# Altium schematic sheet CHARGING.SchDoc
size B
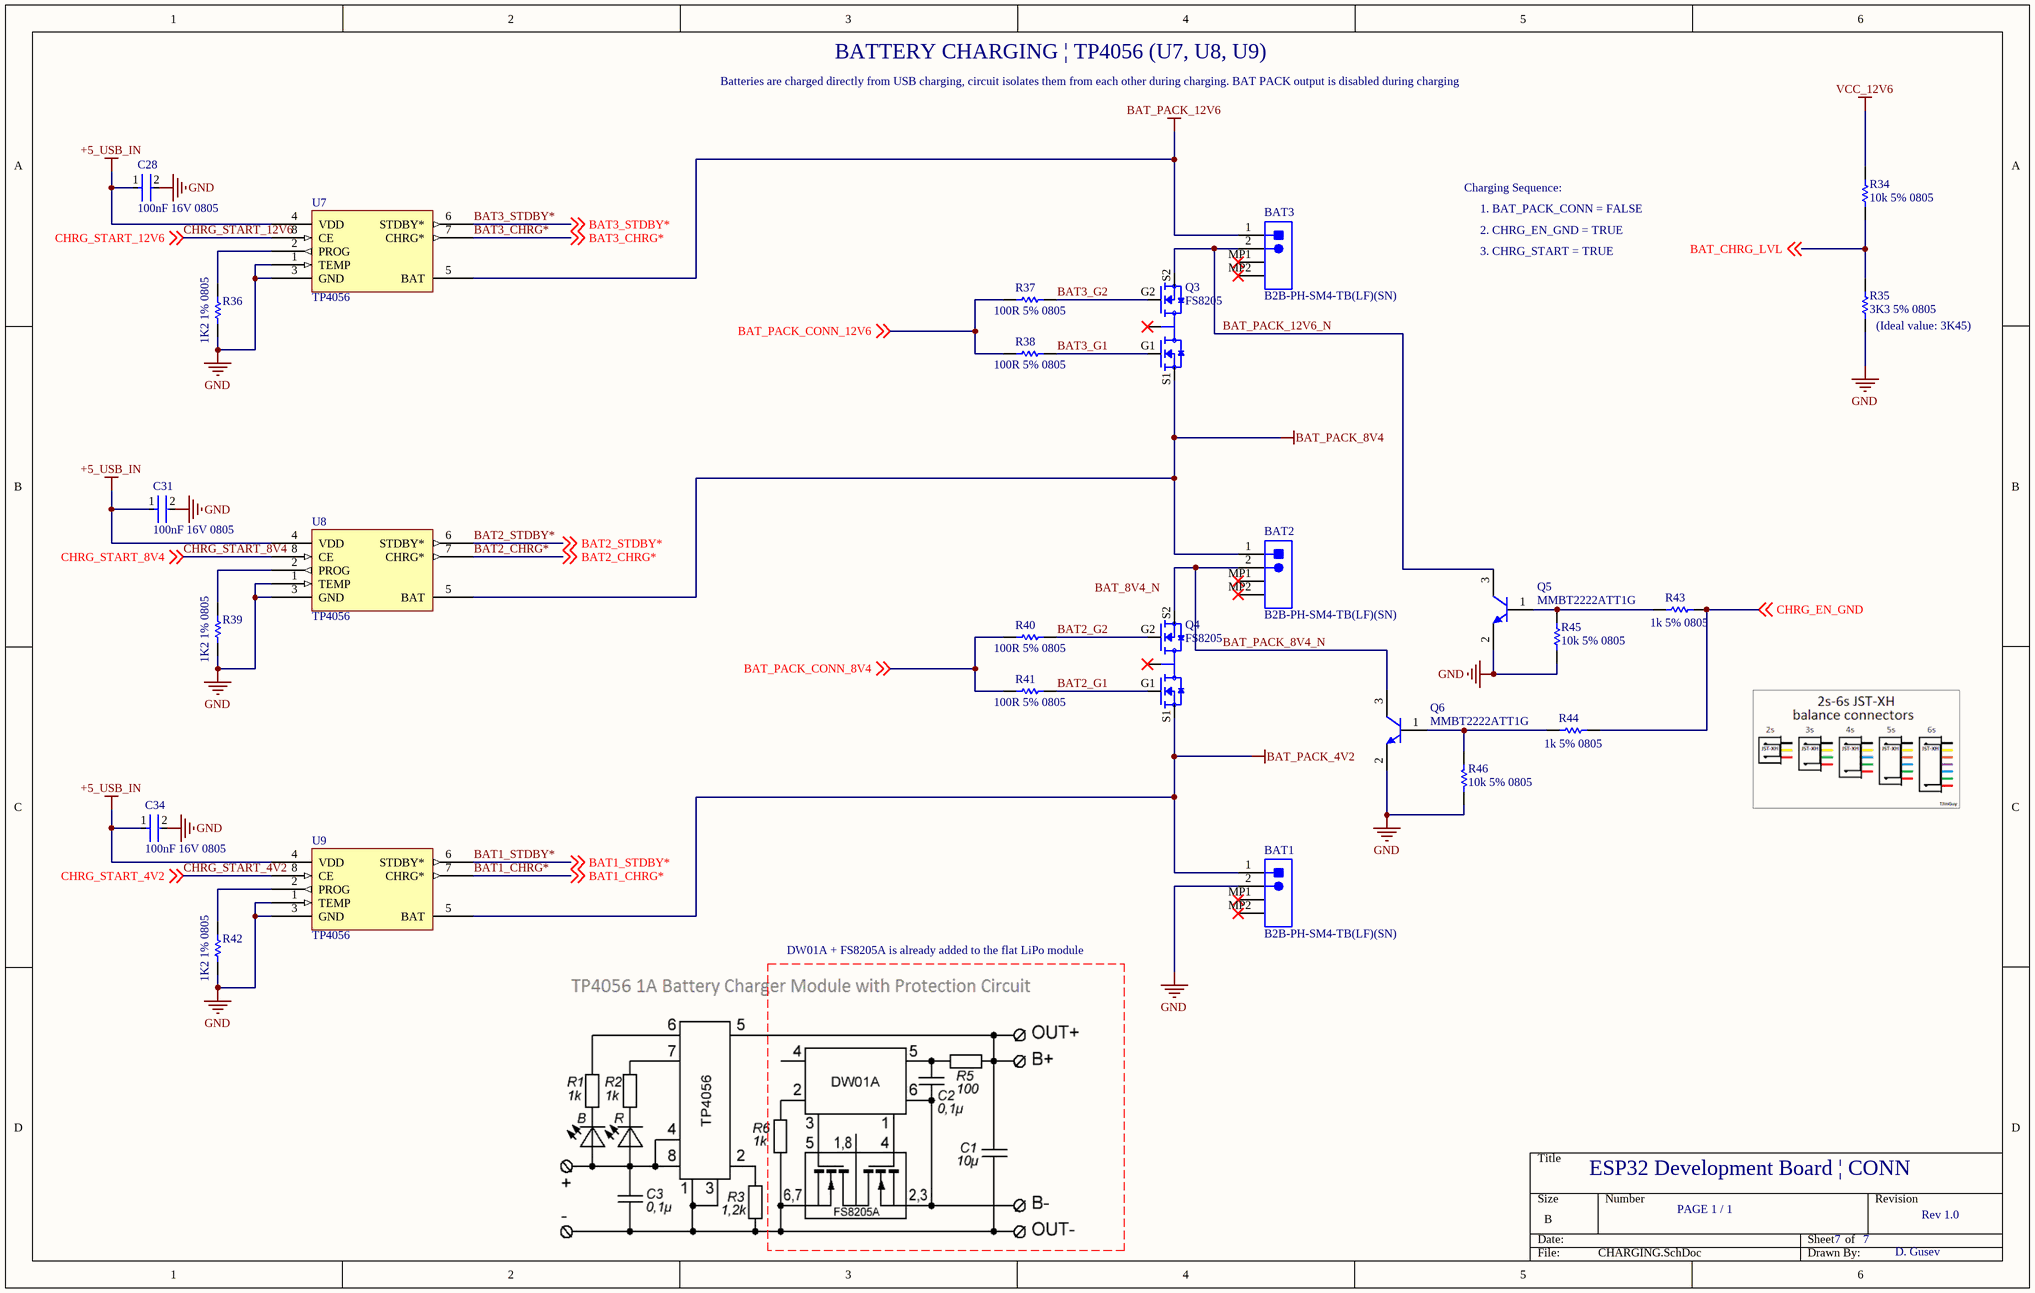
[diagram p0: CHARGING.SchDoc]

## Parts
BAT1  B2B-PH-SM4-TB(LF)(SN)  [JST-B2B-PH-SM4-TB-2_V]
BAT2  B2B-PH-SM4-TB(LF)(SN)  [JST-B2B-PH-SM4-TB-2_V]
BAT3  B2B-PH-SM4-TB(LF)(SN)  [JST-B2B-PH-SM4-TB-2_V]
C28  100nF 16V 0805  [FP-C0805C-DN-MFG]
C31  100nF 16V 0805  [FP-C0805C-DN-MFG]
C34  100nF 16V 0805  [FP-C0805C-DN-MFG]
Q3  FS8205  [FS8205]
Q4  FS8205  [FS8205]
Q5  MMBT2222ATT1G  [ONSC-SC-75-3-463-01_V]
Q6  MMBT2222ATT1G  [ONSC-SC-75-3-463-01_V]
R34  10k 5% 0805  [RESC2013X60X35NL10T20]
R35  3K3 5% 0805  [RESC2013X60X35ML10T20]
R36  1K2 1% 0805  [RESC2013X70X40ML20T20]
R37  100R 5% 0805  [RESC2013X60X35ML10T20]
R38  100R 5% 0805  [RESC2013X60X35ML10T20]
R39  1K2 1% 0805  [RESC2013X70X40ML20T20]
R40  100R 5% 0805  [RESC2013X60X35ML10T20]
R41  100R 5% 0805  [RESC2013X60X35ML10T20]
R42  1K2 1% 0805  [RESC2013X70X40ML20T20]
R43  1k 5% 0805  [RESC2013X60X35ML10T20]
R44  1k 5% 0805  [RESC2013X60X35ML10T20]
R45  10k 5% 0805  [RESC2013X60X35NL10T20]
R46  10k 5% 0805  [RESC2013X60X35NL10T20]
U7  TP4056  [TP4056]
U8  TP4056  [TP4056]
U9  TP4056  [TP4056]

## Nets
+5_USB_IN: C28.1 C31.1 C34.1 U7.4(VDD) U8.4(VDD) U9.4(VDD)
BAT_PACK_4V2: BAT1.1 Q4.S1 U9.5(BAT)
BAT_PACK_8V4: BAT2.1 Q3.S1 U8.5(BAT)
BAT_PACK_12V6: BAT3.1 U7.5(BAT)
GND: BAT1.2 C28.2 C31.2 C34.2 Q5.2(E) Q6.2(E) R35.1 R36.1 R39.1 R42.1 R45.1 R46.2 U7.1(TEMP) U7.3(GND) U8.1(TEMP) U8.3(GND) U9.1(TEMP) U9.3(GND)
VCC_12V6: R34.2
BAT1_CHRG*: U9.7(CHRG*) ; off-sheet BAT1_CHRG*
BAT1_STDBY*: U9.6(STDBY*) ; off-sheet BAT1_STDBY*
BAT2_CHRG*: U8.7(CHRG*) ; off-sheet BAT2_CHRG*
BAT2_G1: Q4.G1 R41.2
BAT2_G2: Q4.G2 R40.2
BAT2_STDBY*: U8.6(STDBY*) ; off-sheet BAT2_STDBY*
BAT3_CHRG*: U7.7(CHRG*) ; off-sheet BAT3_CHRG*
BAT3_G1: Q3.G1 R38.2
BAT3_G2: Q3.G2 R37.2
BAT3_STDBY*: U7.6(STDBY*) ; off-sheet BAT3_STDBY*
BAT_CHRG_LVL: R34.1 R35.2 ; off-sheet BAT_CHRG_LVL
BAT_PACK_8V4_N: BAT2.2 Q4.S2 Q6.3(C)
BAT_PACK_12V6_N: BAT3.2 Q3.S2 Q5.3(C)
BAT_PACK_CONN_8V4: R40.1 R41.1 ; off-sheet BAT_PACK_CONN_8V4
BAT_PACK_CONN_12V6: R37.1 R38.1 ; off-sheet BAT_PACK_CONN_12V6
CHRG_EN_GND: R43.2 R44.2 ; off-sheet CHRG_EN_GND
CHRG_START_4V2: U9.8(CE) ; off-sheet CHRG_START_4V2
CHRG_START_8V4: U8.8(CE) ; off-sheet CHRG_START_8V4
CHRG_START_12V6: U7.8(CE) ; off-sheet CHRG_START_12V6
NetQ5_1: Q5.1(B) R43.1 R45.2
NetQ6_1: Q6.1(B) R44.1 R46.1
NetR36_2: R36.2 U7.2(PROG)
NetR39_2: R39.2 U8.2(PROG)
NetR42_2: R42.2 U9.2(PROG)

Not connected (* = marked no-connect by the designer): BAT1 MP1* MP2*; BAT2 MP1* MP2*; BAT3 MP1* MP2*; Q3 D12*; Q4 D12*

## Notes on the sheet
- Batteries are charged directly from USB charging, circuit isolates them from each other during charging. BAT PACK output is disabled during charging
- BATTERY CHARGING | TP4056 (U7, U8, U9)
- Charging Sequence:
- 1. BAT_PACK_CONN = FALSE
- 2. CHRG_EN_GND = TRUE
- 3. CHRG_START = TRUE
- (near R35) (Ideal value: 3K45)
- DW01A + FS8205A is already added to the flat LiPo module
- ESP32 Development Board | CONN
- PAGE 1 / 1
- 7
- Rev 1.0
- D. Gusev
- Labels drawn without touching a wire or pin: BAT_8V4_N

## Library data of the parts
BAT1-BAT3 = CMP-2000-05163-1: Male Header, Pitch 2 mm, 1 x 2 Position, Height 6.6 mm, RoHS, Tape and Reel; Manufacturer: JST; No of Positions: 2; Style/Orientation: StraightHeader/Plug; Pitch: 2mm; Datasheet URL: https://ciiva.com/datasheet-click-26894756?src=ciiva&sig=90099765; Termination: Crimp; Manufacturer URL: http://www.jst.com/home2.html; Type: ShroudedHeader; Datasheet Version: Dec-12
C28 C31 C34 = CMP-2007-01112-2: CAP CER 0.1UF 16V X7R 0805; Manufacturer Part Number: C0805C104J4RACTU; Manufacturer: KEMET; Value: 0.10 μF; Material: Ceramic; Temperature Coefficient: 30ppm/°C; Tolerance: 0.05; Mouser Description: Multilayer Ceramic Capacitors MLCC - SMD/SMT 16volts 0.1uF X7R 5%; Device Class L2: Capacitors; Temperature: -55°C to +125°C; RoHS: TRUE; Category: Cap; Octopart: https://octopart.com/c0805c104j4ractu-kemet-12563748; Temperature Range Low: -55°C; ComponentLink2URL: https://content.kemet.com/datasheets/KEM_C1003_C0G_SMD.pdf; Ipc Land Pattern Name: CAPC200125X78; Device Class L3: Ceramic Capacitors; Device Class L1: Passive Components; Digikey Description: CAP CER 0.1UF 16V X7R 0805; Temperature Characteristic: X7R; Temperature Range High: +125°C; Package: C0805C-DN; ComponentLink2Description: Datasheet; Capacitance: 0.10 μF; Voltage Rating: 16 V; Height: 0.88mm; Lead Free: Yes; Automotive: No
Q3 Q4 = FS8205: Dual N-Channel Enhancement Mode Power MOSFET; MF: Fortune Semiconductor; Package: Package; MP: FS8205; Value: *; Price: None; SnapEDA_Link: https://www.snapeda.com/parts/FS8205/Fortune%20Semiconductor/view-part/3216395/?ref=snap; Check_prices: https://www.snapeda.com/parts/FS8205/Fortune%20Semiconductor/view-part/3216395/?ref=eda; Availability: In Stock
Q5 Q6 = CMP-1048-00417-1: General Purpose Transistor, NPN Silicon, 3-Pin SC-75, Pb-Free, Tape and Reel; Manufacturer: On Semiconductor; IC Continuous (A): 0.6; fT Min (MHz): 300; DatasheetVersion: Rev. 5; PackageVersion: Rev. F, 07/2005; ComponentLink1Description: Manufacturer URL; RoHS: TRUE; Packing: Tape and Reel; ComponentLink3URL: http://www.onsemi.com/pub_link/Collateral/463-01.PDF; ComponentLink1URL: http://www.onsemi.com/; ComponentLink3Description: Package Specification; ComponentLink2URL: http://www.onsemi.cn/pub_link/Collateral/MMBT2222ATT1-D.PDF; Mounting Technology: Surface Mount; PartNumber: MMBT2222ATT1G; ComponentLink2Description: Datasheet; Polarity: NPN; PackageReference: SC-75-3-463-01; PackageDescription: 3-Pin Small Outline Transistor, Body 1.6 x 0.8 mm, Pitch 0.5 mm
R34 R45 R46 = CMP-1659-00013-4: Chip Resistor, 10 KOhm, +/- 1%, 0.125 W, -55 to 155 degC, 0805 (2012 Metric), RoHS, Tape and Reel; Manufacturer: Yageo; Voltage Rating: 150 V; Mount: Surface Mount; ComponentLink1Description: Manufacturer URL; ComponentLink2URL: http://www.yageo.com/documents/recent/PYu-RC_Group_51_RoHS_L_04.pdf; Pins: 2; Length: 2 mm; Min Operating Temperature: -55 degC; Height: 0.5 mm; Mounting Technology: Surface Mount; RoHSCompliant: true; REACH SVHC: No SVHC; ComponentLink1URL: http://www.yageo.com/; Max Operating Temperature: 155 degC; PackageReference: 0805; DatasheetVersion: Rev. 4, 02/2016; Package Quantity: 5000; Packaging: Tape and Reel; ComponentLink2Description: Datasheet; PackageDescription: 2-Pin Surface Mounted Device, Body 2 x 1.25 mm
R35 = CMP-1013-00567-2: Chip Resistor, 3.3 KOhm, +/- 1%, 0.125 W, -55 to 155 degC, 0805 (2012 Metric), RoHS, Tape and Reel; Manufacturer: Yageo; Voltage Rating: 150V; Max Power Dissipation: 125mW; Temperature Coefficient: 100ppm/degreesC; Package Quantity: 1; Max Operating Temperature: 155degC; Case Code (Metric): 2012; Package Reference: 0805; Resistance: 3.3KOhm; Composition: ThickFilm; RoHSCompliant: true; Case/Package: 0805; Case Code (Imperial): 0805; Tolerance: 1%; Depth: 1.25mm; Weight: 0.000194oz; Lead Free: LeadFree; Min Operating Temperature: -55degC; Termination: SMD/SMT; Datasheet Version: Rev. 5, 10/2016; REACH SVHC: NoSVHC; Power Rating: 125mW; Packaging: TapeandReel; Number of Terminations: 2; Width: 0.049inch; Package Description: 2-Pin Surface Mounted Device, Body 2 x 1.25 mm; Datasheet URL: http://www.yageo.com/NewPortal/yageodocoutput?fileName=/pdf/R-Chip/PYu-RC_Group_51_RoHS_L_5.pdf; Height: 0.5mm; Length: 2mm; Manufacturer URL: http://www.yageo.com/
R36 R39 R42 = CMP-2001-00512-1: Manufacturer: Panasonic; Part Number: ERJ6ENF1201V
R37 R38 R40 R41 = CMP-2100-03669-1: Chip Resistor, 100 Ohm, +/-1%, 0.125 W, -55 to 155 degC, 0805 (2012 Metric), RoHS, Tape and Reel; Manufacturer: Yageo; Power Rating: 125mW; Resistance: 100Ohm; Voltage Rating: 150V; Tolerance: 1%; Temperature Coefficient: 100ppm/degreesC; Length: 2mm; Package Description: 2-Pin Surface Mounted Device, Body 2 x 1.25 mm; Case Code (Imperial): 0805; Number of Pins: 2; Termination: SMD/SMT; Lead Pitch: 0.4mm; Package Quantity: 1; Height: 0.024inch; Case Code (Metric): 2012; Number of Terminations: 2; Datasheet Version: Rev. 5, 10/2016; Lead Free: LeadFree; Package Reference: 0805; Composition: ThickFilm; REACH SVHC: Unknown; Voltage Rating (DC): 150V; Min Operating Temperature: -55degC; Packaging: TapeandReel; Military Standard: Not; Case/Package: 0805; Datasheet URL: http://www.yageo.com/NewPortal/yageodocoutput?fileName=/pdf/R-Chip/PYu-RC_Group_51_RoHS_L_5.pdf; Max Operating Temperature: 155degC; Manufacturer URL: http://www.yageo.com/; Max Power Dissipation: 125mW; Width: 0.049inch; Depth: 1.25mm; RoHSCompliant: true
R43 R44 = CMP-2100-03671-1: Chip Resistor, 1 KOhm, +/- 1%, 125 mW, -55 to 155 degC, 0805 (2012 Metric), RoHS, Tape and Reel; Manufacturer: Yageo; Temperature Coefficient: 100ppm/degreesC; Voltage Rating (DC): 150V; Max Power Dissipation: 125mW; Resistance: 1KOhm; Number of Pins: 2; Number of Terminations: 2; Datasheet URL: http://www.yageo.com/NewPortal/yageodocoutput?fileName=/pdf/R-Chip/PYu-RC_Group_51_RoHS_L_5.pdf; Length: 0.079inch; Package Description: 2-Pin Surface Mounted Device, Body 2 x 1.25 mm; Depth: 1.25mm; Height: 0.024inch; Military Standard: Not; Case/Package: 0805; Package Reference: 0805; RoHSCompliant: true; Lead Free: LeadFree; Packaging: TapeandReel; Package Quantity: 1; Datasheet Version: Rev. 5, 10/2016; Tolerance: 1%; Min Operating Temperature: -55degC; Voltage Rating: 150V; Composition: ThickFilm; Case Code (Imperial): 0805; Power Rating: 125mW; Width: 0.049inch; Case Code (Metric): 2012; Manufacturer URL: http://www.yageo.com/; Max Operating Temperature: 155degC; REACH SVHC: Unknown; Termination: SMD/SMT
U7-U9 = TP4056: 1-CELL LI+ BATTERY CHARGER